# Altium schematic sheet demo_dermis_main_testboard_dig.SchDoc
size A0
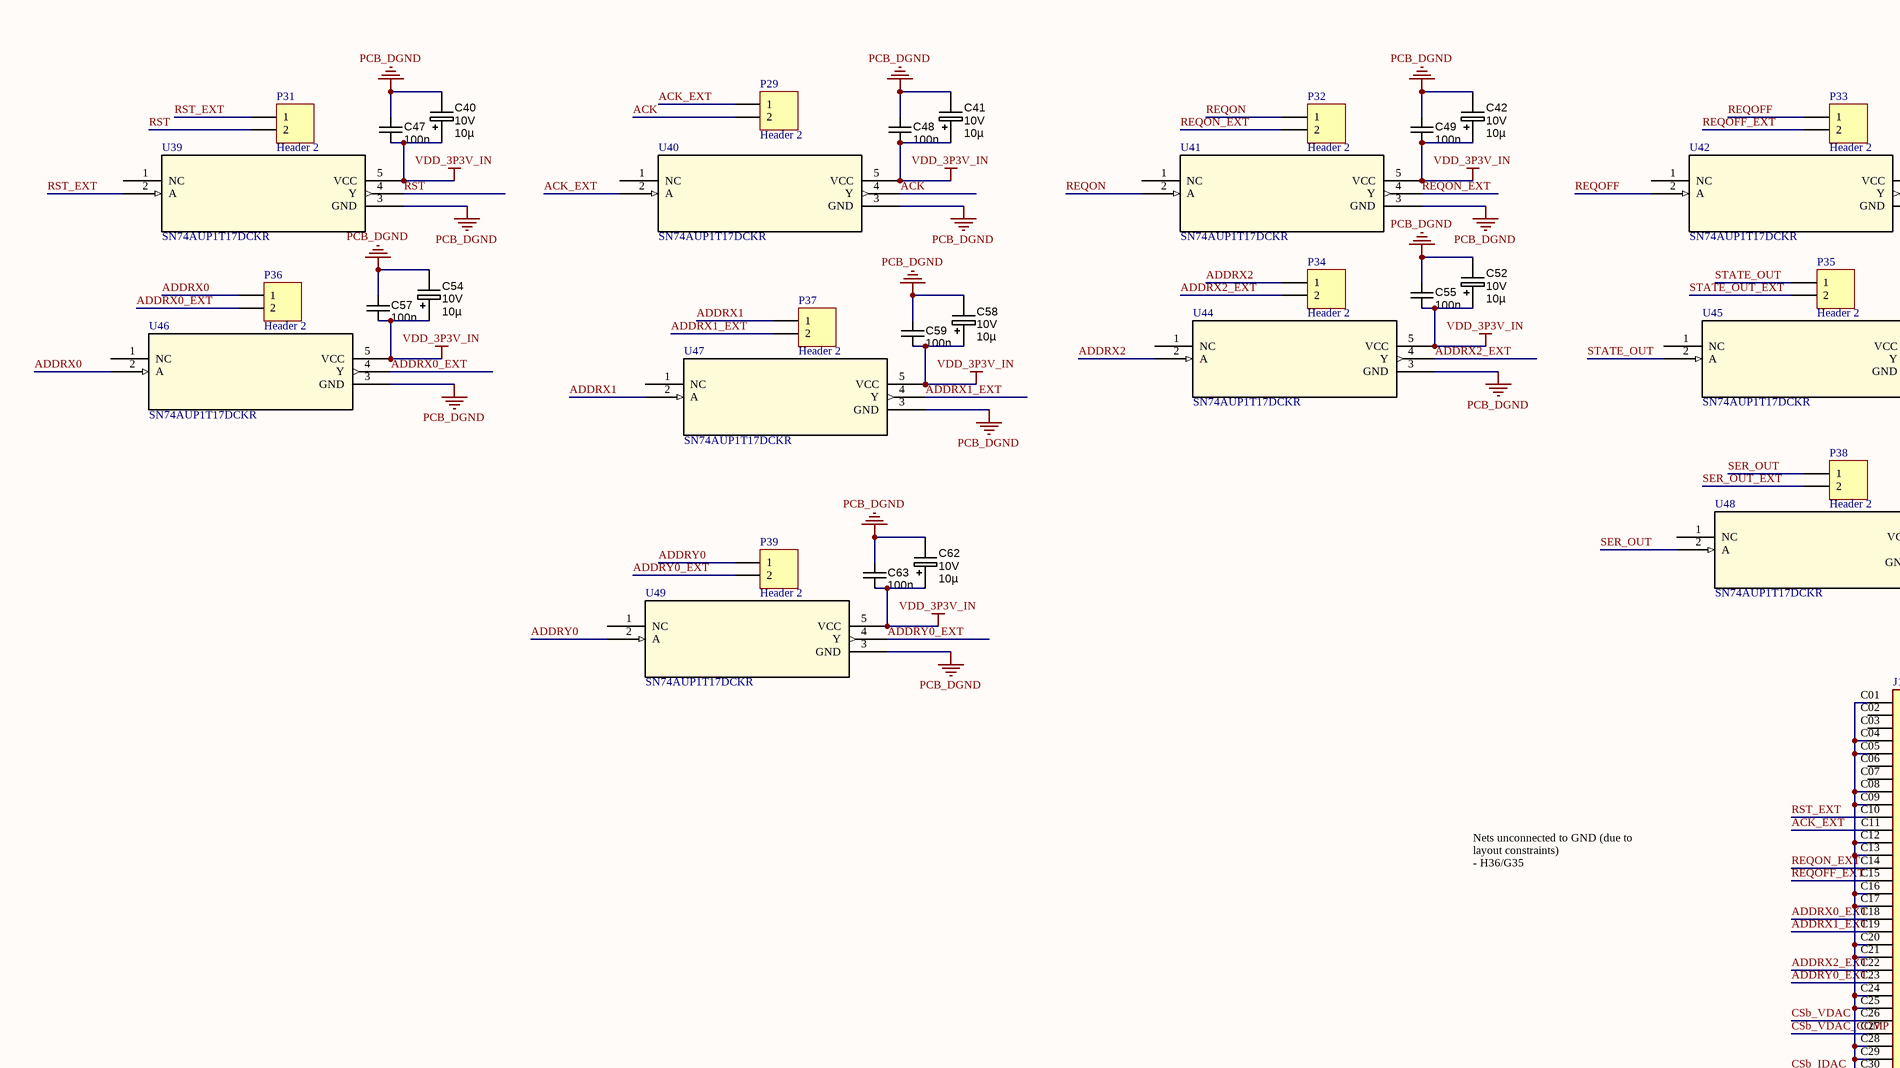
[diagram p0: demo_dermis_main_testboard_dig.SchDoc, top left]
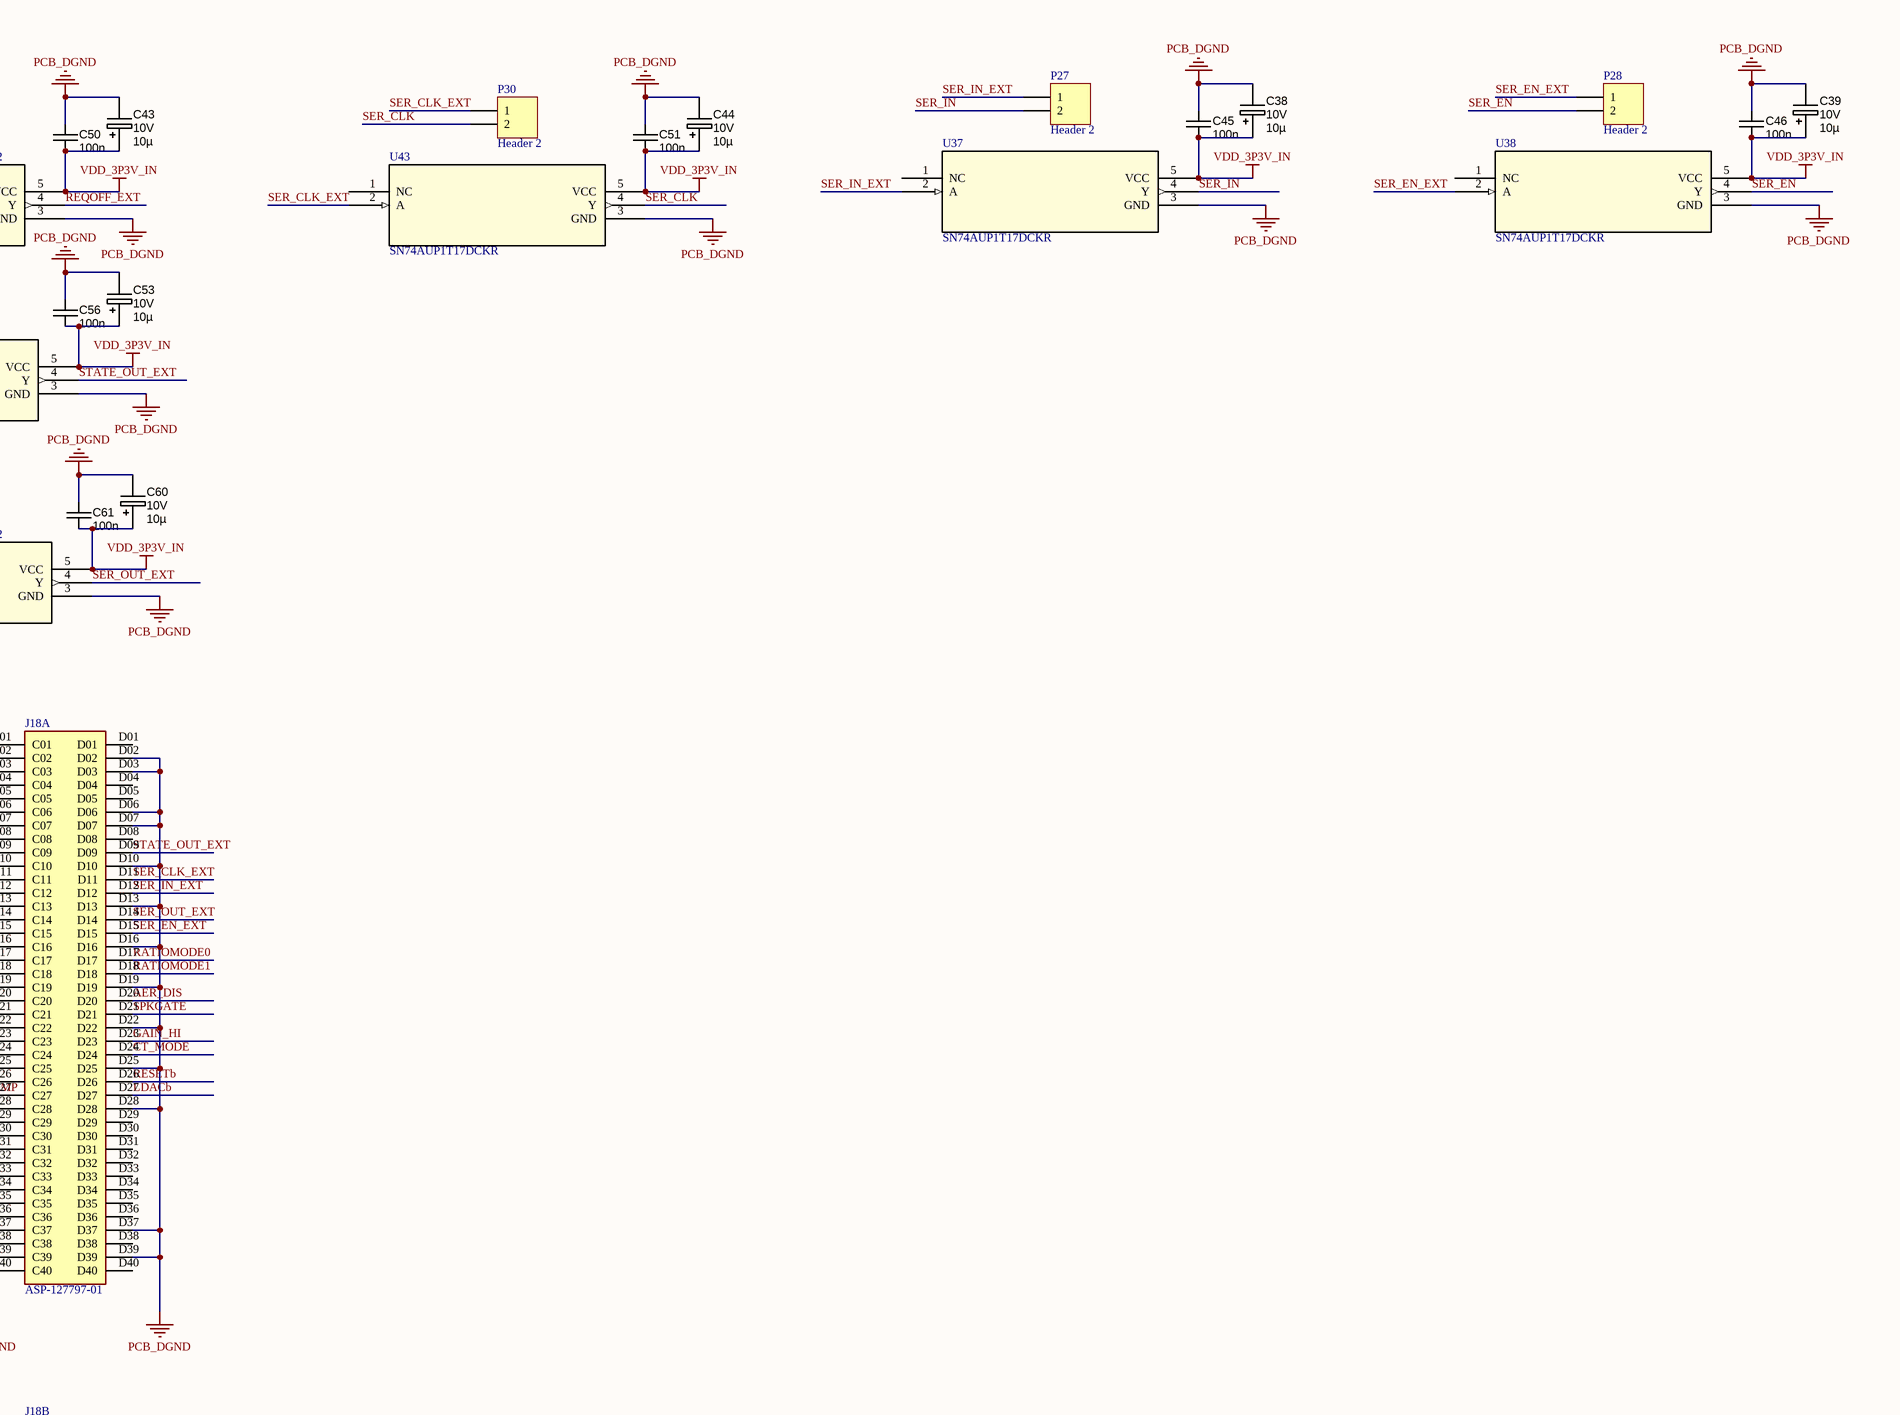
[diagram p1: demo_dermis_main_testboard_dig.SchDoc, top right]
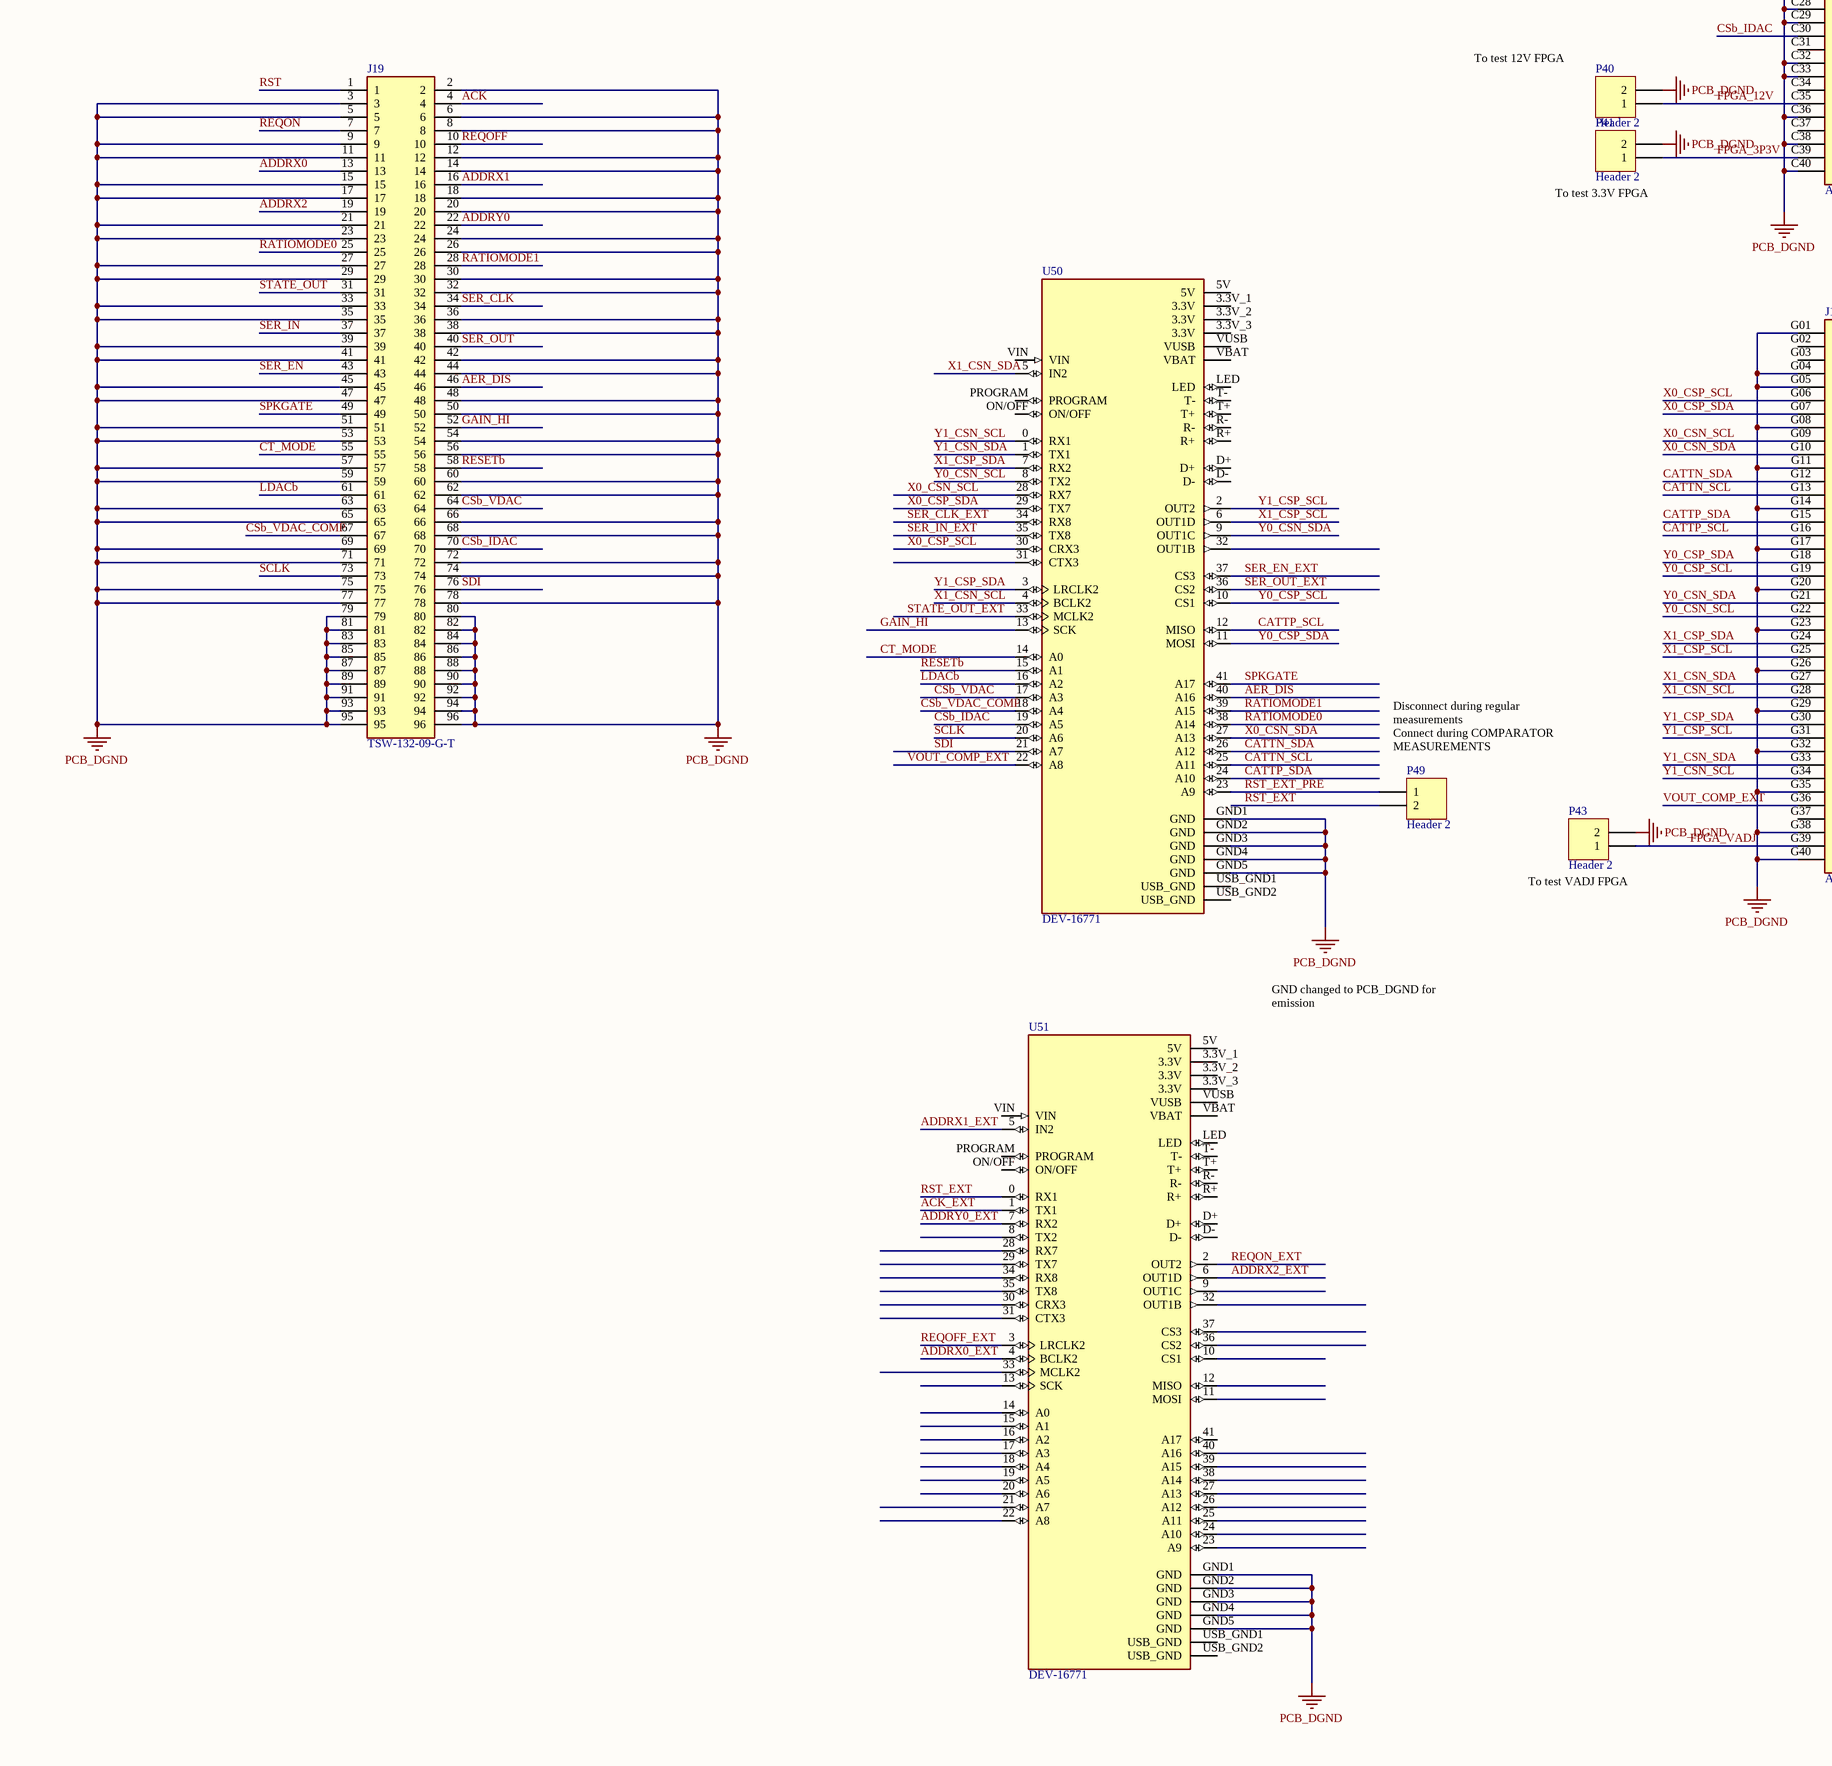
[diagram p2: demo_dermis_main_testboard_dig.SchDoc, bottom left]
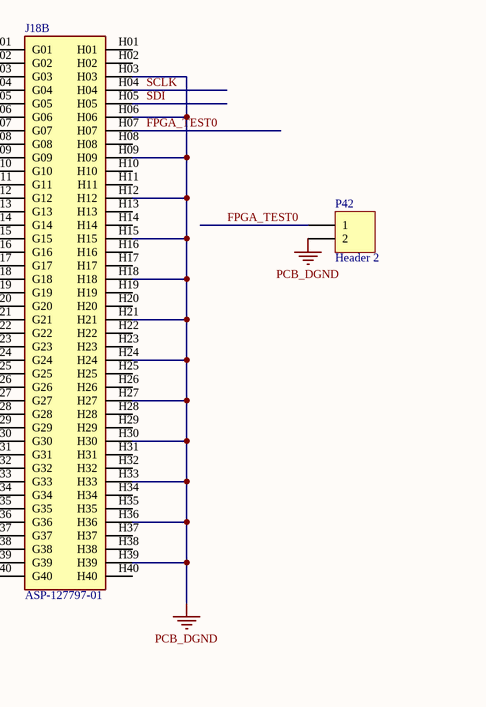
[diagram p3: demo_dermis_main_testboard_dig.SchDoc, bottom right]

## Parts
C38  Ratings: 10V  [CAPMP2012X150USR]  (hidden comment: 10µ)
C39  Ratings: 10V  [CAPMP2012X150USR]  (hidden comment: 10µ)
C40  Ratings: 10V  [CAPMP2012X150USR]  (hidden comment: 10µ)
C41  Ratings: 10V  [CAPMP2012X150USR]  (hidden comment: 10µ)
C42  Ratings: 10V  [CAPMP2012X150USR]  (hidden comment: 10µ)
C43  Ratings: 10V  [CAPMP2012X150USR]  (hidden comment: 10µ)
C44  Ratings: 10V  [CAPMP2012X150USR]  (hidden comment: 10µ)
C45  value 100n  [CAPC1608N]  (hidden comment: approved sub OK)
C46  value 100n  [CAPC1608N]  (hidden comment: approved sub OK)
C47  value 100n  [CAPC1608N]  (hidden comment: approved sub OK)
C48  value 100n  [CAPC1608N]  (hidden comment: approved sub OK)
C49  value 100n  [CAPC1608N]  (hidden comment: approved sub OK)
C50  value 100n  [CAPC1608N]  (hidden comment: approved sub OK)
C51  value 100n  [CAPC1608N]  (hidden comment: approved sub OK)
C52  Ratings: 10V  [CAPMP2012X150USR]  (hidden comment: 10µ)
C53  Ratings: 10V  [CAPMP2012X150USR]  (hidden comment: 10µ)
C54  Ratings: 10V  [CAPMP2012X150USR]  (hidden comment: 10µ)
C55  value 100n  [CAPC1608N]  (hidden comment: approved sub OK)
C56  value 100n  [CAPC1608N]  (hidden comment: approved sub OK)
C57  value 100n  [CAPC1608N]  (hidden comment: approved sub OK)
C58  Ratings: 10V  [CAPMP2012X150USR]  (hidden comment: 10µ)
C59  value 100n  [CAPC1608N]  (hidden comment: approved sub OK)
C60  Ratings: 10V  [CAPMP2012X150USR]  (hidden comment: 10µ)
C61  value 100n  [CAPC1608N]  (hidden comment: approved sub OK)
C62  Ratings: 10V  [CAPMP2012X150USR]  (hidden comment: 10µ)
C63  value 100n  [CAPC1608N]  (hidden comment: approved sub OK)
J18  ASP-127797-01  [SAMTEC_ASP-127797-01]  (parts A,B of 2)
J19  TSW-132-09-G-T  [HDRV96W64P254_3X32_8128X749X838P]
P27  Header 2  [HDR1X2]
P28  Header 2  [HDR1X2]
P29  Header 2  [HDR1X2]
P30  Header 2  [HDR1X2]
P31  Header 2  [HDR1X2]
P32  Header 2  [HDR1X2]
P33  Header 2  [HDR1X2]
P34  Header 2  [HDR1X2]
P35  Header 2  [HDR1X2]
P36  Header 2  [HDR1X2]
P37  Header 2  [HDR1X2]
P38  Header 2  [HDR1X2]
P39  Header 2  [HDR1X2]
P40  Header 2  [HDR1X2]
P41  Header 2  [HDR1X2]
P42  Header 2  [HDR1X2]
P43  Header 2  [HDR1X2]
P49  Header 2  [HDR1X2]
U37  SN74AUP1T17DCKR  [DCK5]
U38  SN74AUP1T17DCKR  [DCK5]
U39  SN74AUP1T17DCKR  [DCK5]
U40  SN74AUP1T17DCKR  [DCK5]
U41  SN74AUP1T17DCKR  [DCK5]
U42  SN74AUP1T17DCKR  [DCK5]
U43  SN74AUP1T17DCKR  [DCK5]
U44  SN74AUP1T17DCKR  [DCK5]
U45  SN74AUP1T17DCKR  [DCK5]
U46  SN74AUP1T17DCKR  [DCK5]
U47  SN74AUP1T17DCKR  [DCK5]
U48  SN74AUP1T17DCKR  [DCK5]
U49  SN74AUP1T17DCKR  [DCK5]
U50  DEV-16771  [MODULE_DEV-16771]
U51  DEV-16771  [MODULE_DEV-16771]

## Nets
PCB_DGND: C38.2 C39.2 C40.2 C41.2 C42.2 C43.2 C44.2 C45.2 C46.2 C47.2 C48.2 C49.2 C50.2 C51.2 C52.2 C53.2 C54.2 C55.2 C56.2 C57.2 C58.2 C59.2 C60.2 C61.2 C62.2 C63.2 J18.C01 J18.C04 J18.C05 J18.C08 J18.C09 J18.C12 J18.C13 J18.C16 J18.C17 J18.C20 J18.C21 J18.C24 J18.C25 J18.C28 J18.C29 J18.C32 J18.C33 J18.C36 J18.C38 J18.C40 J18.D02 J18.D03 J18.D06 J18.D07 J18.D10 J18.D13 J18.D16 J18.D19 J18.D22 J18.D25 J18.D28 J18.D37 J18.D39 J18.G01 J18.G04 J18.G05 J18.G08 J18.G11 J18.G14 J18.G17 J18.G20 J18.G23 J18.G26 J18.G29 J18.G32 J18.G35 J18.G38 J18.G40 J18.H03 J18.H06 J18.H09 J18.H12 J18.H15 J18.H18 J18.H21 J18.H24 J18.H27 J18.H30 J18.H33 J18.H36 J18.H39 J19.2 J19.3 J19.5 J19.6 J19.8 J19.9 J19.11 J19.12 J19.14 J19.15 J19.17 J19.18 J19.20 J19.21 J19.23 J19.24 J19.26 J19.27 J19.29 J19.30 J19.32 J19.33 J19.35 J19.36 J19.38 J19.39 J19.41 J19.42 J19.44 J19.45 J19.47 J19.48 J19.50 J19.51 J19.53 J19.54 J19.56 J19.57 J19.59 J19.60 J19.62 J19.63 J19.65 J19.66 J19.68 J19.69 J19.71 J19.72 J19.74 J19.75 J19.77 J19.78 J19.79 J19.80 J19.81 J19.82 J19.83 J19.84 J19.85 J19.86 J19.87 J19.88 J19.89 J19.90 J19.91 J19.92 J19.93 J19.94 J19.95 J19.96 P40.2 P41.2 P42.2 P43.2 U37.3(GND) U38.3(GND) U39.3(GND) U40.3(GND) U41.3(GND) U42.3(GND) U43.3(GND) U44.3(GND) U45.3(GND) U46.3(GND) U47.3(GND) U48.3(GND) U49.3(GND) U50.GND1(GND) U50.GND2(GND) U50.GND3(GND) U50.GND4(GND) U50.GND5(GND) U51.GND1(GND) U51.GND2(GND) U51.GND3(GND) U51.GND4(GND) U51.GND5(GND)
VDD_3P3V_IN: C38.1 C39.1 C40.1 C41.1 C42.1 C43.1 C44.1 C45.1 C46.1 C47.1 C48.1 C49.1 C50.1 C51.1 C52.1 C53.1 C54.1 C55.1 C56.1 C57.1 C58.1 C59.1 C60.1 C61.1 C62.1 C63.1 U37.5(VCC) U38.5(VCC) U39.5(VCC) U40.5(VCC) U41.5(VCC) U42.5(VCC) U43.5(VCC) U44.5(VCC) U45.5(VCC) U46.5(VCC) U47.5(VCC) U48.5(VCC) U49.5(VCC)
ACK: J19.4 P29.2 U40.4(Y)
ACK_EXT: J18.C11 P29.1 U40.2(A) U51.1(TX1)
ADDRX0: J19.13 P36.1 U46.2(A)
ADDRX0_EXT: J18.C18 P36.2 U46.4(Y) U51.4(BCLK2)
ADDRX1: J19.16 P37.1 U47.2(A)
ADDRX1_EXT: J18.C19 P37.2 U47.4(Y) U51.5(IN2)
ADDRX2: J19.19 P34.1 U44.2(A)
ADDRX2_EXT: J18.C22 P34.2 U44.4(Y) U51.6(OUT1D)
ADDRY0: J19.22 P39.1 U49.2(A)
ADDRY0_EXT: J18.C23 P39.2 U49.4(Y) U51.7(RX2)
AER_DIS: J18.D20 J19.46 U50.40(A16)
CATTN_SCL: J18.G13 U50.25(A11)
CATTN_SDA: J18.G12 U50.26(A12)
CATTP_SCL: J18.G16 U50.12(MISO)
CATTP_SDA: J18.G15 U50.24(A10)
CSb_IDAC: J18.C30 J19.70 U50.19(A5)
CSb_VDAC: J18.C26 J19.64 U50.17(A3)
CSb_VDAC_COMP: J18.C27 J19.67 U50.18(A4)
CT_MODE: J18.D24 J19.55 U50.14(A0)
FPGA_3P3V: J18.C39 P41.1
FPGA_12V: J18.C35 P40.1
FPGA_TEST0: J18.H07 P42.1
FPGA_VADJ: J18.G39 P43.1
GAIN_HI: J18.D23 J19.52 U50.13(SCK)
LDACb: J18.D27 J19.61 U50.16(A2)
RATIOMODE0: J18.D17 J19.25 U50.38(A14)
RATIOMODE1: J18.D18 J19.28 U50.39(A15)
REQOFF: J19.10 P33.1 U42.2(A)
REQOFF_EXT: J18.C15 P33.2 U42.4(Y) U51.3(LRCLK2)
REQON: J19.7 P32.1 U41.2(A)
REQON_EXT: J18.C14 P32.2 U41.4(Y) U51.2(OUT2)
RESETb: J18.D26 J19.58 U50.15(A1)
RST: J19.1 P31.2 U39.4(Y)
RST_EXT: J18.C10 P31.1 P49.2 U39.2(A) U51.0(RX1)
RST_EXT_PRE: P49.1 U50.23(A9)
SCLK: J18.H04 J19.73 U50.20(A6)
SDI: J18.H05 J19.76 U50.21(A7)
SER_CLK: J19.34 P30.2 U43.4(Y)
SER_CLK_EXT: J18.D11 P30.1 U43.2(A) U50.34(RX8)
SER_EN: J19.43 P28.2 U38.4(Y)
SER_EN_EXT: J18.D15 P28.1 U38.2(A) U50.37(CS3)
SER_IN: J19.37 P27.2 U37.4(Y)
SER_IN_EXT: J18.D12 P27.1 U37.2(A) U50.35(TX8)
SER_OUT: J19.40 P38.1 U48.2(A)
SER_OUT_EXT: J18.D14 P38.2 U48.4(Y) U50.36(CS2)
SPKGATE: J18.D21 J19.49 U50.41(A17)
STATE_OUT: J19.31 P35.1 U45.2(A)
STATE_OUT_EXT: J18.D09 P35.2 U45.4(Y) U50.33(MCLK2)
VOUT_COMP_EXT: J18.G36 U50.22(A8)
X0_CSN_SCL: J18.G09 U50.28(RX7)
X0_CSN_SDA: J18.G10 U50.27(A13)
X0_CSP_SCL: J18.G06 U50.30(CRX3)
X0_CSP_SDA: J18.G07 U50.29(TX7)
X1_CSN_SCL: J18.G28 U50.4(BCLK2)
X1_CSN_SDA: J18.G27 U50.5(IN2)
X1_CSP_SCL: J18.G25 U50.6(OUT1D)
X1_CSP_SDA: J18.G24 U50.7(RX2)
Y0_CSN_SCL: J18.G22 U50.8(TX2)
Y0_CSN_SDA: J18.G21 U50.9(OUT1C)
Y0_CSP_SCL: J18.G19 U50.10(CS1)
Y0_CSP_SDA: J18.G18 U50.11(MOSI)
Y1_CSN_SCL: J18.G34 U50.0(RX1)
Y1_CSN_SDA: J18.G33 U50.1(TX1)
Y1_CSP_SCL: J18.G31 U50.2(OUT2)
Y1_CSP_SDA: J18.G30 U50.3(LRCLK2)

Not connected (* = marked no-connect by the designer): J18 C02 C03 C06 C07 C31 C34 C37 D01 D04 D05 D08 D29 D30 D31 D32 D33 D34 D35 D36 D38 D40 G02 G03 G37 H01 H02 H08 H10 H11 H13 H14 H16 H17 H19 H20 H22 H23 H25 H26 H28 H29 H31 H32 H34 H35 H37 H38 H40; U37 1(NC); U38 1(NC); U39 1(NC); U40 1(NC); U41 1(NC); U42 1(NC); U43 1(NC); U44 1(NC); U45 1(NC); U46 1(NC); U47 1(NC); U48 1(NC); U49 1(NC); U50 3.3V_1(3.3V) 3.3V_2(3.3V) 3.3V_3(3.3V) 5V 31(CTX3) 32(OUT1B) D+ D- LED ON/OFF PROGRAM R+ R- T+ T- USB_GND1(USB_GND) USB_GND2(USB_GND) VBAT VIN VUSB; U51 3.3V_1(3.3V) 3.3V_2(3.3V) 3.3V_3(3.3V) 5V 8(TX2) 9(OUT1C) 10(CS1) 11(MOSI) 12(MISO) 13(SCK) 14(A0) 15(A1) 16(A2) 17(A3) 18(A4) 19(A5) 20(A6) 21(A7) 22(A8) 23(A9) 24(A10) 25(A11) 26(A12) 27(A13) 28(RX7) 29(TX7) 30(CRX3) 31(CTX3) 32(OUT1B) 33(MCLK2) 34(RX8) 35(TX8) 36(CS2) 37(CS3) 38(A14) 39(A15) 40(A16) 41(A17) D+ D- LED ON/OFF PROGRAM R+ R- T+ T- USB_GND1(USB_GND) USB_GND2(USB_GND) VBAT VIN VUSB

## Notes on the sheet
- Nets unconnected to GND (due to layout constraints)
  - H36/G35
- To test 12V FPGA
- (near P41) To test 3.3V FPGA
- (near P49) Disconnect during regular measurements
  Connect during COMPARATOR MEASUREMENTS
- (near P43) To test VADJ FPGA
- GND changed to PCB_DGND for emission
- Title
- Size:
- Date:
- File:
- A0
- Number:
- Time:
- Revision:
- Sheet
- of

## Library data of the parts
C38-C44 C52-C54 C58 C60 C62 = CAPT_10u_0805_10V: Capacitor SMD Tantalum 10uF 20% 10V 0805; Manufacturer 1: AVX Corporation; Manufacturer Part Number 1: TAJP106M010RNJ; Package / Case: 0805 (2012 metric); Tolerance: ±20%; Material: Tantalum; Supplier 1: Digi-Key; Supplier Part Number 1: 478-3281-1-ND; Value: 10µ
C45-C51 C55-C57 C59 C61 C63 = CAPC_100n_0603: Capacitor SMD Cer 100nF 10% 50V X7R 0603; Manufacturer 1: AVX Corporation; Manufacturer Part Number 1: 06035C104KAT2A; Ratings: 50V; X7R; Material: ceramic; Manufacturer 2: TDK Corporation; Manufacturer Part Number 2: C1608X7R1H104K; Package / Case: 0603 (1608 Metric); Tolerance: ±10%; Supplier 1: Digi-Key; Supplier Part Number 1: 478-5052-1-ND; ComponentLink1URL: http://www.avx.com/docs/Catalogs/cx7r.pdf; ComponentLink1Description: http://www.avx.com/docs/Catalogs/cx7r.pdf; Supplier 2: Digi-Key; Supplier Part Number 2: 445-1314-1-ND; ComponentLink2URL: http://product.tdk.com/capacitor/mlcc/en/documents/mlcc_commercial_general_en.pdf; ComponentLink2Description: http://product.tdk.com/capacitor/mlcc/en/documents/mlcc_commercial_general_en.pdf
J18 = ASP-127797-01: 160 Position Connector Array, Male Pins Surface Mount Gold; MF: Samtec Inc.; Package: None; Price: None; Check_prices: https://www.snapeda.com/parts/ASP-127797-01/Samtec+Inc./view-part/?ref=eda; Value: *; SnapEDA_Link: https://www.snapeda.com/parts/ASP-127797-01/Samtec+Inc./view-part/?ref=snap; MP: ASP-127797-01; Availability: In Stock; Purchase-URL: https://pricing.snapeda.com/search?q=ASP-127797-01&ref=eda
J19 = TSW-132-09-G-T: CONN HEADER 96 POS .100"; Manufacturer_Name: SAMTEC; Geometry.Height: 8.38mm; Farnell Part Number: *; Farnell Price/Stock: *; Manufacturer_Part_Number: TSW-132-09-G-T; Datasheet Link: http://suddendocs.samtec.com/catalog_english/tsw_th.pdf
P27-P43 P49 = Header 2: Header, 2-Pin; LatestRevisionDate: 17-Jul-2002; LatestRevisionNote: Re-released for DXP Platform.; Publisher: Altium Limited
U37-U49 = SN74AUP1T17DCKR: No Description Available; Mfr_Name: Texas Instruments; RefDes: RefDes; Type: Type
U50 U51 = DEV-16771: RT1062 Teensy 4.1 series ARM® Cortex®-M7 MPU Embedded Evaluation Board; MF: SparkFun Electronics; SnapEDA_Link: https://www.snapeda.com/parts/DEV-16771/SparkFun+Electronics/view-part/?ref=snap; Package: None; Value: *; MP: DEV-16771; Check_prices: https://www.snapeda.com/parts/DEV-16771/SparkFun+Electronics/view-part/?ref=eda